# Altium schematic sheet RS232 Interface.SchDoc
size 297 x 209 mm; SheetNumber: 5; SheetTotal: 5; swcgroup: Innovation and Research; Org: Sainsbury Wellcome Centre; Add1: 25 Howland Street; Add2: London; Add3: W1T 4JG; WebAddress: www.sainsburywellcome.org; SheetSize: A4; SheetName: RS232 Interface
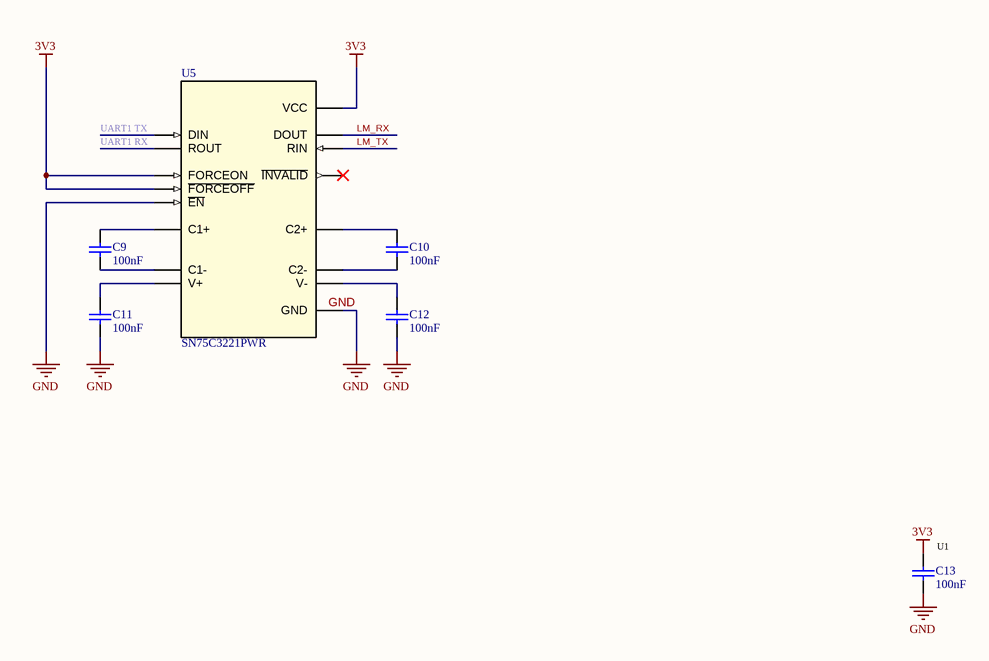
[diagram p0: RS232 Interface.SchDoc]

## Parts
C9  value 100nF  [FP-GRM188-0_1-e0_2_0_5-IPC_B]  (hidden comment: C0603-100nF-100V-10%-X7R)
C10  value 100nF  [FP-GRM188-0_1-e0_2_0_5-IPC_B]  (hidden comment: C0603-100nF-100V-10%-X7R)
C11  value 100nF  [FP-GRM188-0_1-e0_2_0_5-IPC_B]  (hidden comment: C0603-100nF-100V-10%-X7R)
C12  value 100nF  [FP-GRM188-0_1-e0_2_0_5-IPC_B]  (hidden comment: C0603-100nF-100V-10%-X7R)
C13  value 100nF  [FP-GRM188-0_1-e0_2_0_5-IPC_B]  (hidden comment: C0603-100nF-100V-10%-X7R)
U5  SN75C3221PWR  [PW0016A_N]

## Nets
3V3: C13.2 U5.12(FORCEON) U5.15(VCC) U5.16(~{FORCEOFF})
GND: C11.1 C12.1 C13.1 U5.1(~{EN}) U5.14(GND)
LM_RX: U5.13(DOUT)
LM_TX: U5.8(RIN)
UART1 RX: U5.9(ROUT)
UART1 TX: U5.11(DIN)
NetC9_1: C9.1 U5.4(C1-)
NetC9_2: C9.2 U5.2(C1+)
NetC10_1: C10.1 U5.6(C2-)
NetC10_2: C10.2 U5.5(C2+)
NetC11_2: C11.2 U5.3(V+)
NetC12_2: C12.2 U5.7(V-)

Not connected (* = marked no-connect by the designer): U5 10(~{INVALID})*

## Notes on the sheet
- (near C13) U1
- FILE
- VARIANT
- DATE
- REVISION
- SHEET
- /
- PROJECT
- SIZE

## Library data of the parts
C9-C13 = CMP-611-0027-15: 0.1µF ±10% 100V Ceramic Capacitor X7R 0603 (1608 Metric); Pick&PlaceFootprint: 0603_CAP; Dielectric: X7R; REACH SVHC: No SVHC; Case Code (Metric): 1608; Series: GRM; Case/Package: 0603; Capacitance: 100nF; RoHS Compliant: Yes; Radiation Hardening: No; Case Code (Imperial): 0603; Min Operating Temperature: -55°C; Capacitor Type: Ceramic; Voltage Rating: 100V; Construction: Flat; Lead Free: Lead Free; Size: 0.8mm; Packaging: Tape and Reel; Voltage Rating (DC): 100V; Voltage: 100V; Width: 0.8mm; Max Operating Temperature: 125°C; RoHS: Yes; Material: Ceramic; Depth: 0.8mm; Thickness: 0.035inch; Termination: SMD/SMT; Weight: 0.000222oz; Length: 1.6mm; Mount: Surface Mount; Height: 0.8mm; Package Quantity: 1; Tolerance: 10%
U5 = CMP-930-0000-8: IC RS232 DRVR/RCVR 1-CH 16-TSSOP; Nominal Supply Current: 1mA; Data Rate: 1000Kbps; Number of Transmitters: 1; Min Supply Voltage: 3V; Max Supply Voltage: 5.5V; Simplex/Duplex: Full Duplex; Logic Function: Transceiver,Receiver; Operating Supply Voltage: 5V; Pick&PlaceFootprint: TSSOP-14; Min Operating Temperature: 0°C; Packaging: Tape and Reel; Package Quantity: 1; Case/Package: TSSOP; REACH SVHC: No SVHC; Mount: Surface Mount; Number of Drivers: 1; Radiation Hardening: No; Weight: 0.002183oz; Max Operating Temperature: 70°C; Number of Receivers: 1; Number of Pins: 16; Lead Free: Lead Free; Number of Transceivers: 1; Operating Supply Current: 1mA; PartNumber: SN75C3221PWR